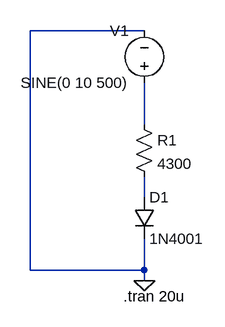
[diagram p0: schematic Biasing for Rectifier Diode.asc]
Biasing for Rectifier Diode.asc, the LTspice schematic file:
Version 4
SHEET 1 880 680
WIRE 176 -128 0 -128
WIRE 176 16 176 -48
WIRE 176 128 176 96
WIRE 0 240 0 -128
WIRE 176 240 176 192
WIRE 176 240 0 240
WIRE 176 256 176 240
FLAG 176 256 0
SYMBOL diode 160 128 R0
SYMATTR InstName D1
SYMATTR Value 1N4001
SYMBOL res 160 0 R0
SYMATTR InstName R1
SYMATTR Value 4300
SYMBOL voltage 176 -32 R180
WINDOW 0 24 96 Left 2
WINDOW 3 24 16 Left 2
WINDOW 123 0 0 Left 0
WINDOW 39 0 0 Left 0
SYMATTR InstName V1
SYMATTR Value SINE(0 10 500)
TEXT 144 280 Left 2 !.tran 20u

The netlist it stands for:
* Biasing for Rectifier Diode.asc
D1 N002 0 1N4001
R1 N001 N002 4300
V1 N001 0 SINE(0 10 500)
.model D D
.lib standard.dio
.tran 20u
.backanno
.end